# Altium project Brd_3_PCB_Golden_Arduino.PrjPcb
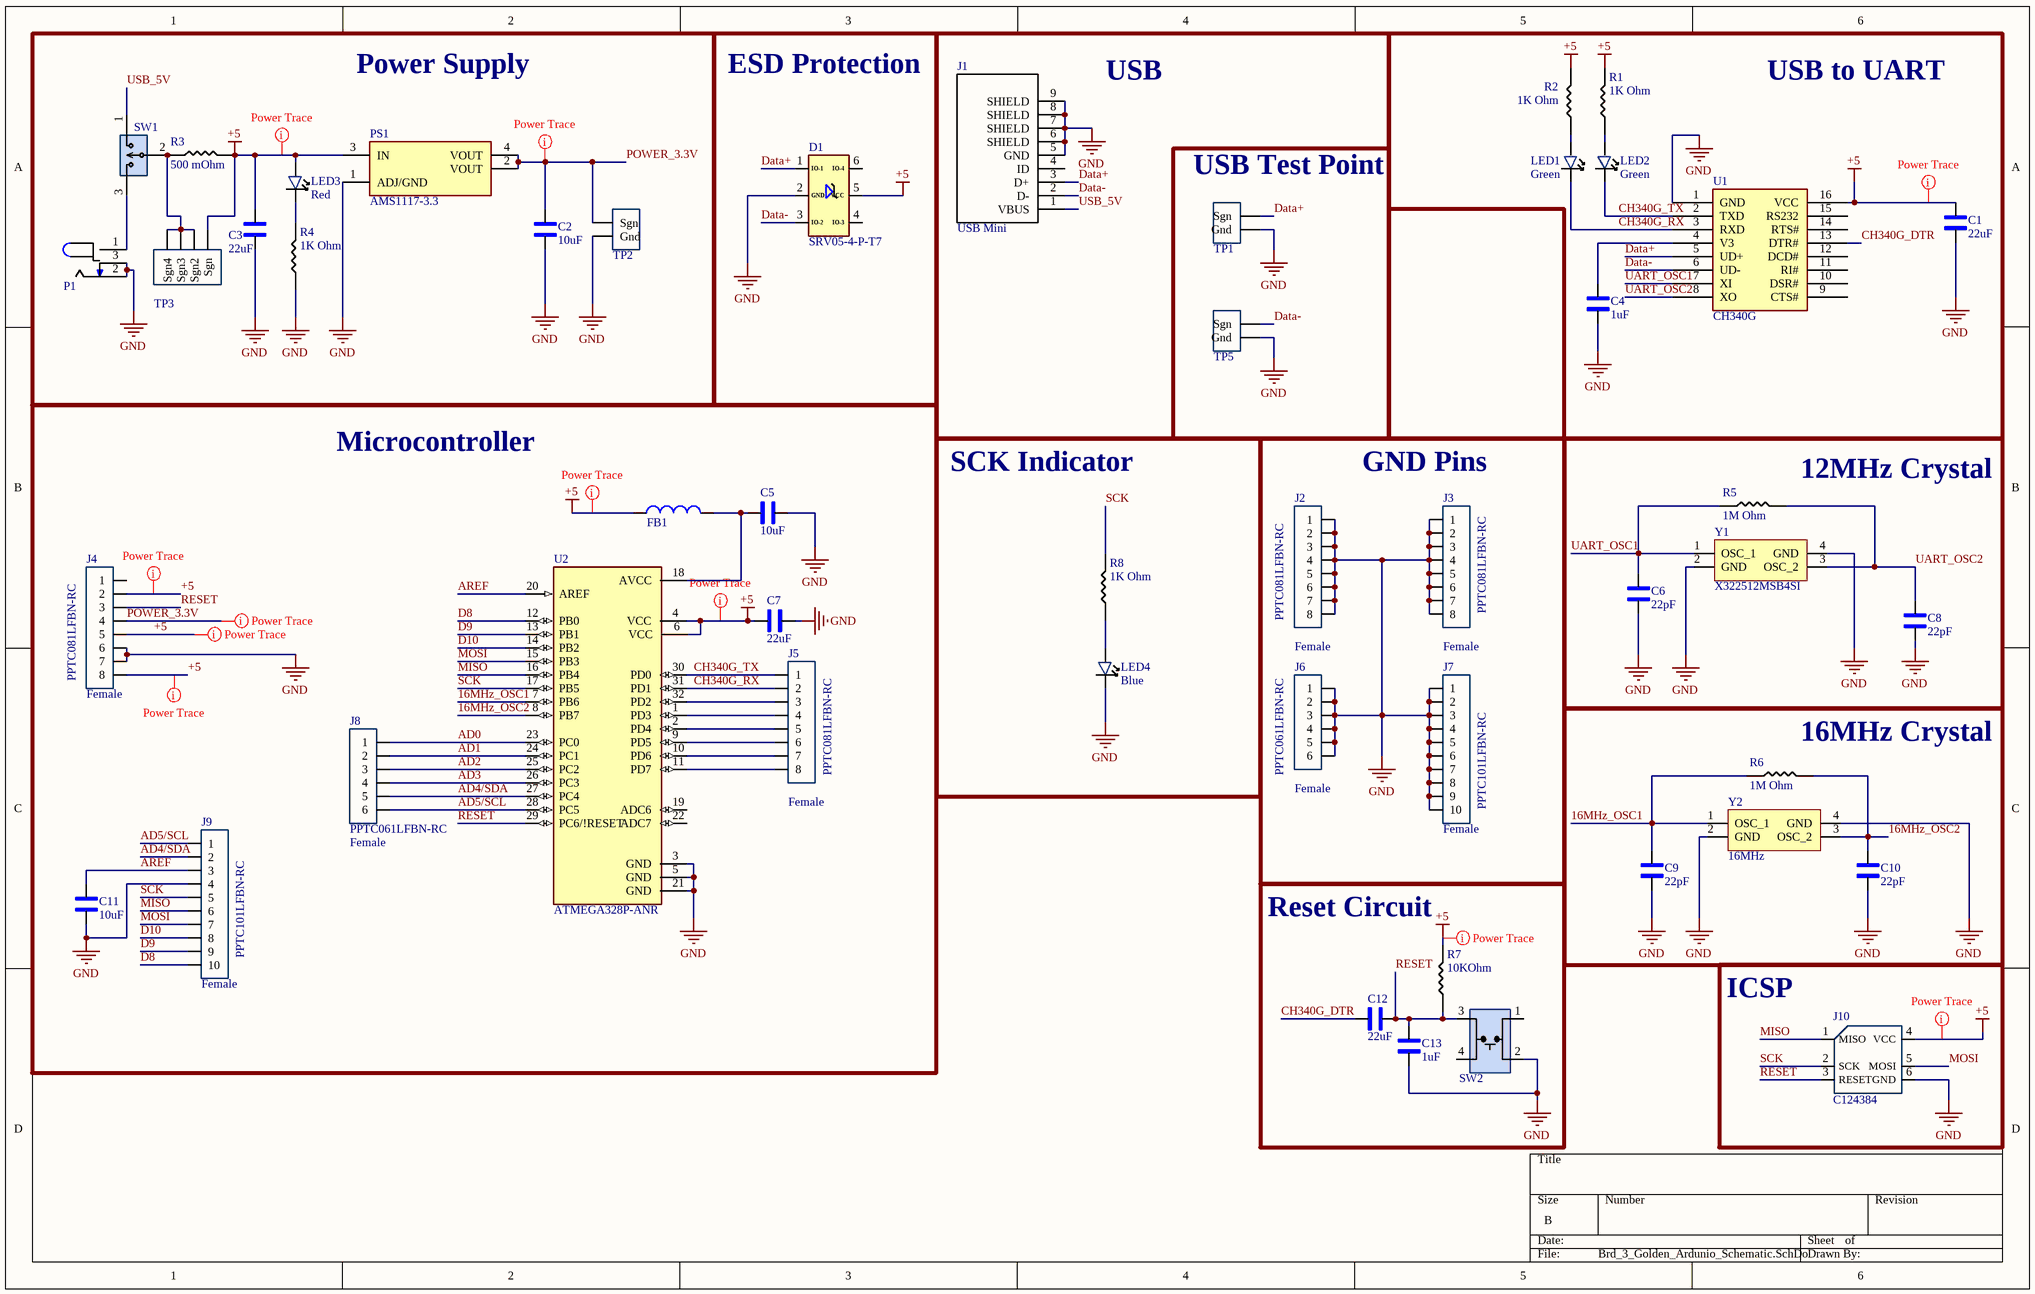
[diagram p0: Brd_3_Golden_Ardunio_Schematic.SchDoc]
1 sheet, 49 parts. Net scope: global (net labels, ports and power ports of the same name join across sheets).
Board file: Brd_3_Golden_Arduino_Layout.PcbDoc

## Sheet Brd_3_Golden_Ardunio_Schematic.SchDoc
size B; SheetNumber: 1; SheetTotal: 1

### Parts
C1  22uF  [0805_Passive_Capaciitor]
C2  10uF  [0402_Passive_Capacitor]
C3  22uF  [0805_Passive_Capaciitor]
C4  1uF  [0402_Passive_Capacitor]
C5  10uF  [0402_Passive_Capacitor]
C6  22pF  [0402_Passive_Capacitor]
C7  22uF  [0805_Passive_Capaciitor]
C8  22pF  [0402_Passive_Capacitor]
C9  22pF  [0402_Passive_Capacitor]
C10  22pF  [0402_Passive_Capacitor]
C11  10uF  [0402_Passive_Capacitor]
C12  22uF  [0805_Passive_Capaciitor]
C13  1uF  [0402_Passive_Capacitor]
D1  SRV05-4-P-T7  [TVS]
FB1  FB_10uH_0603  [0603_PASSIVE_Capacitor]  (value not drawn)
J1  USB Mini  [USB_MINI_B]
J2  PPTC081LFBN-RC  value Female  [8_PIN_ARDUINO_100MIL]
J3  PPTC081LFBN-RC  value Female  [8_PIN_ARDUINO_100MIL]
J4  PPTC081LFBN-RC  value Female  [8_PIN_ARDUINO_100MIL]
J5  PPTC081LFBN-RC  value Female  [8_PIN_ARDUINO_100MIL]
J6  PPTC061LFBN-RC  value Female  [6_PIN_ARDUINO_100mil]
J7  PPTC101LFBN-RC  value Female  [10_PIN_ARDUINO_100MIL]
J8  PPTC061LFBN-RC  value Female  [6_PIN_ARDUINO_100mil]
J9  PPTC101LFBN-RC  value Female  [10_PIN_ARDUINO_100MIL]
J10  LCSC Part#: C124384  [ICSP]  (hidden comment: NRPN032PAEN-RC)
LED1  value Green  [LED_0603]  (hidden comment: KT-0603R)
LED2  value Green  [LED_0603]  (hidden comment: KT-0603R)
LED3  value Red  [LED_0603]  (hidden comment: KT-0603R)
LED4  value Blue  [LED_0603]  (hidden comment: KT-0603R)
P1  Power Jack  [Power_Jack]  (value not drawn)
PS1  AMS1117-3.3  [LDO]
R1  value 1K Ohm  [0402_Passive_Resistor]  (hidden comment: 1k)
R2  value 1K Ohm  [0402_Passive_Resistor]  (hidden comment: 1k)
R3  value 500 mOhm  [0603_PASSIVE_Resistor]  (hidden comment: 500m)
R4  value 1K Ohm  [0402_Passive_Resistor]  (hidden comment: 1k)
R5  value 1M Ohm  [1206_Passive_Resitor]  (hidden comment: 1M)
R6  value 1M Ohm  [1206_Passive_Resitor]  (hidden comment: 1M)
R7  value 10KOhm  [0402_Passive_Resistor]  (hidden comment: 10k)
R8  value 1K Ohm  [0402_Passive_Resistor]  (hidden comment: 1k)
SW1  PREC003SAAN-RC  [3_PIN_100mil]  (value not drawn)
SW2  TL3305AF160QG  [Switch_JLC]  (value not drawn)
TP1  10x Probe TP  [TP10x_Probe]  (value not drawn)
TP2  10x Probe TP  [TP10x_Probe]  (value not drawn)
TP3  10x Probe Floating TP  [TP10x_Floating]  (value not drawn)
TP5  10x Probe TP  [TP10x_Probe]  (value not drawn)
U1  CH340G  [USB to serial]
U2  ATMEGA328P-ANR  [ATMega328P]
Y1  X322512MSB4SI  [Crystal resonator]
Y2  value 16MHz  [Crystal resonator]  (hidden comment: X322516MLB4SI)

### Blocks framed on the sheet
Power Supply: C2 C3 LED3 P1 PS1 R3 R4 SW1 TP2 TP3
ESD Protection: D1
USB: J1
USB to UART: C1 C4 LED1 LED2 R1 R2 U1
USB Test Point: TP1 TP5
Microcontroller: C5 C7 C11 FB1 J4 J5 J8 J9 U2
SCK Indicator: LED4 R8
GND Pins: J2 J3 J6 J7
12MHz Crystal: C6 C8 R5 Y1
16MHz Crystal: C9 C10 R6 Y2
Reset Circuit: C12 C13 R7 SW2
ICSP: J10

### Nets
+5: C1.2 C3.2 C7.1 D1.5(VCC) FB1.1 J4.2 J4.5 J4.8 J10.4(VCC) LED3.1 PS1.3(IN) R1.2 R2.2 R3.2 R7.2 TP3.1(Sgn) U1.16(VCC) U2.4(VCC) U2.6(VCC)
GND: C1.1 C2.1 C3.1 C4.1 C5.2 C6.1 C7.2 C8.1 C9.1 C10.1 C11.1 C13.1 D1.2(GND) J1.5(GND) J1.6(SHIELD) J1.7(SHIELD) J1.8(SHIELD) J1.9(SHIELD) J2.1 J2.2 J2.3 J2.4 J2.5 J2.6 J2.7 J2.8 J3.1 J3.2 J3.3 J3.4 J3.5 J3.6 J3.7 J3.8 J4.6 J4.7 J6.1 J6.2 J6.3 J6.4 J6.5 J6.6 J7.1 J7.2 J7.3 J7.4 J7.5 J7.6 J7.7 J7.8 J7.9 J7.10 J9.4 J10.6(GND) LED4.2 P1.2 P1.3 PS1.1(ADJ/GND) R4.1 SW2.2 TP1.2(Gnd) TP2.2(Gnd) TP5.2(Gnd) U1.1(GND) U2.3(GND) U2.5(GND) U2.21(GND) Y1.2(GND) Y1.4(GND) Y2.2(GND) Y2.4(GND)
16MHz_OSC1: C9.2 R6.1 U2.7(PB6) Y2.1(OSC_1)
16MHz_OSC2: C10.2 R6.2 U2.8(PB7) Y2.3(OSC_2)
AD0: J8.1 U2.23(PC0)
AD1: J8.2 U2.24(PC1)
AD2: J8.3 U2.25(PC2)
AD3: J8.4 U2.26(PC3)
AD4/SDA: J8.5 J9.2 U2.27(PC4)
AD5/SCL: J8.6 J9.1 U2.28(PC5)
AREF: C11.2 J9.3 U2.20(AREF)
CH340G_DTR: C12.1 U1.13(DTR#)
CH340G_RX: J5.2 LED1.2 U1.3(RXD) U2.31(PD1)
CH340G_TX: J5.1 LED2.2 U1.2(TXD) U2.30(PD0)
D8: J9.10 U2.12(PB0)
D9: J9.9 U2.13(PB1)
D10: J9.8 U2.14(PB2)
Data+: D1.1(IO-1) J1.3(D+) TP1.1(Sgn) U1.5(UD+)
Data-: D1.3(IO-2) J1.2(D-) TP5.1(Sgn) U1.6(UD-)
MISO: J9.6 J10.1(MISO) U2.16(PB4)
MOSI: J9.7 J10.5(MOSI) U2.15(PB3)
POWER_3.3V: C2.2 J4.4 PS1.2(VOUT) PS1.4(VOUT) TP2.1(Sgn)
RESET: C12.2 C13.2 J4.3 J10.3(RESET) R7.1 SW2.3 U2.29(PC6/!RESET)
SCK: J9.5 J10.2(SCK) R8.2 U2.17(PB5)
UART_OSC1: C6.2 R5.1 U1.7(XI) Y1.1(OSC_1)
UART_OSC2: C8.2 R5.2 U1.8(XO) Y1.3(OSC_2)
USB_5V: J1.1(VBUS) SW1.1
NetC4_2: C4.2 U1.4(V3)
NetC5_1: C5.1 FB1.2 U2.18(AVCC)
NetJ5_3: J5.3 U2.32(PD2)
NetJ5_4: J5.4 U2.1(PD3)
NetJ5_5: J5.5 U2.2(PD4)
NetJ5_6: J5.6 U2.9(PD5)
NetJ5_7: J5.7 U2.10(PD6)
NetJ5_8: J5.8 U2.11(PD7)
NetLED1_1: LED1.1 R2.1
NetLED2_1: LED2.1 R1.1
NetLED3_2: LED3.2 R4.2
NetLED4_1: LED4.1 R8.1
NetP1_1: P1.1 SW1.3
NetR3_1: R3.1 SW1.2 TP3.2(Sgn2) TP3.3(Sgn3) TP3.4(Sgn4)

Not connected (* = marked no-connect by the designer): D1 4(IO-3) 6(IO-4); J1 4(ID); J4 1; SW2 1 4; U1 9(CTS#) 10(DSR#) 11(RI#) 12(DCD#) 14(RTS#) 15(RS232); U2 19(ADC6) 22(ADC7)

### Layout directives
rule Width Constraint [Pref Width = 20mil    Min Width = 20mil    Max Width = 20mil]: +5, POWER_3.3V

### Library data of the parts
C1 C3 C7 C12 = C_22uF_0805: MULTILAYER CERAMIC CAPACITORS MLCC - SMD/SMT 22UF 25V 0805 ROHS; MFR Part #: CL21A226MAQNNNE; Type: Basic; Datasheet: https://datasheet.lcsc.com/szlcsc/Samsung-Electro-Mechanics-CL21A226MAQNNNE_C45783.pdf; LCSC Part#: C45783; Value: 22uF
C2 C5 C11 = C_10uF_0402: 10uF ±20% 6.3V X5R 0402 Multilayer Ceramic Capacitors MLCC - SMD/SMT RoHS; MFR Part #: CL05A106MQ5NUNC; Type: Basic; LCSC Part#: C15525; Datasheet: https://datasheet.lcsc.com/lcsc/1810191215_Samsung-Electro-Mechanics-CL05A106MQ5NUNC_C15525.pdf; Value: 10uF
C4 C13 = C_1uF_0402: MULTILAYER CERAMIC CAPACITORS MLCC - SMD/SMT 1UF 25V 0402 ROHS; MFR Part #: CL05A105KA5NQNC; Type: Basic; Datasheet: https://datasheet.lcsc.com/szlcsc/Samsung-Electro-Mechanics-CL05A105KA5NQNC_C52923.pdf; LCSC Part#: C52923; Value: 1uF
C6 C8-C10 = C_22pF_0402: MULTILAYER CERAMIC CAPACITORS MLCC - SMD/SMT 22PF 50V 0402 ROHS; MFR Part #: 0402CG220J500NT; Type: Basic; Datasheet: https://datasheet.lcsc.com/szlcsc/Guangdong-Fenghua-Advanced-Tech-0402CG220J500NT_C1555.pdf; LCSC Part#: C1555; Value: 22pF
D1 = D_TVS_Diode: TVS SOT-23-6 ROHS; Value: TVS DIODE 5.5V 6TSOP; Type: Basic; MFR Part #: SRV05-4-P-T7; LCSC Part#: C85364; Datasheet: https://datasheet.lcsc.com/szlcsc/ProTek-Devices-SRV05-4-P-T7_C85364.pdf
FB1 = FB_10uH_0603: 10 uH, 30 Q, 1.85 Ohm Series Resistance, 17MHz Self Resonant Frequency,Inductor , SMD 0603, 3 Amps rated current; MFR Part #: SDFL1608S100KTF; Type: Basic; Datasheet: https://datasheet.lcsc.com/szlcsc/Sunlord-SDFL1608S100KTF_C1035.pdf; LCSC Part#: C1035
J1 = J_USB_B_Mini: Through Hole USB Connectors RoHS; MFR Part #: 920-462A2021D10102; Value: USB mini B; LCSC Part#: C46398; Datasheet: https://datasheet.lcsc.com/szlcsc/2103081233_Jing-Extension-of-the-Electronic-Co-920-462A2021D10102_C46398.pdf; Type: Extended
J2-J5 = JF_8_PIN_FEMALE_ARDUINO: 8 Position Header Connector 0.100" (2.54mm) Through Hole Tin; Digikey Link: https://www.digikey.com/product-detail/en/PPTC081LFBN-RC/S7006-ND/810147/?itemSeq=304982354; Digikey Part: S7006-ND; Type: Extended; LCSC Part#: C27438
J6 J8 = JF_6_PIN_FEMALE_ARDUINO: 6 Position Header Connector 0.100" (2.54mm) Through Hole Tin; Digikey Link: https://www.digikey.com/product-detail/en/PPTC061LFBN-RC/S7004-ND/810145/?itemSeq=304982353; Digikey Part: S7004-ND; LCSC Part#: C40877; Type: Extended
J7 J9 = JF_10_PIN_FEMALE_ARDUINO: 10 Position Header Connector 0.100" (2.54mm) Through Hole Tin; Digikey Link: https://www.digikey.com/product-detail/en/PPTC101LFBN-RC/S7008-ND/810149/?itemSeq=304982352; Digikey Part: S7008-ND; LCSC Part#: C225507; Type: Extended
J10 = J_ICSP: Connector Header Through Hole 6 position 0.079" (2.00mm); Digikey Link: https://www.digikey.com/product-detail/en/NRPN032PAEN-RC/S5801-03-ND/804955/?itemSeq=304982355; Digikey Part: S5801-03-ND; Value: NRPN032PAEN-RC; Type: Extended
LED1 LED2 = LED_GREEN_0603: LIGHT EMITTING DIODES (LED) GREEN 520~535NM 112~258MCD@20MA TOP VIEW 0603 ROHS; MFR Part #: 19-217/GHC-YR1S2/3T; Type: Basic; LCSC Part#: C72043
LED3 = LED_RED_0603: LIGHT EMITTING DIODES (LED) RED 520~625NM 90~100MCD@20MA TOP VIEW 0603 ROHS; Type: Basic; Datasheet: https://datasheet.lcsc.com/szlcsc/Everlight-Elec-19-217-BHC-ZL1M2RY-3T_C72041.pdf; MFR Part #: KT-0603R; LCSC Part#: C2286
LED4 = LED_BLUE_0603: LIGHT EMITTING DIODES (LED) BLUE 465~475NM 11.5~28.5MCD@5MA TOP VIEW 0603 ROHS; MFR Part #: 19-217/BHC-ZL1M2RY/3T; Type: Basic; LCSC Part#: C72041
P1 = P_Power Jack: Power Barrel Connector Jack 2.10mm ID (0.083"), 5.50mm OD (0.217") Through Hole, Right Angle; Value: CONN PWR JACK 2X5.5MM SOLDER; Digikey Link: https://www.digikey.com/product-detail/en/PJ-102A/CP-102A-ND/275425/?itemSeq=304982367; Digikey Part: CP-102A-ND; LCSC Part#: C136744; Type: Extended
PS1 = PS_AMS_LDO_3v3: LOW DROPOUT REGULATORS(LDO) POSITIVE FIXED 1.3V @ 800MA 15V 3.3V 1A SOT-223 ROHS; Value: IC REG LINEAR 3.3V 800MA SOT223; MFR Part #: AMS1117-3.3; LCSC Part#: C6186; Type: Basic
R1 R2 R4 R8 = R_1K_0402: 1 kOhms chip resistor SURFACE MOUNT 1KOHMS ±1% 1/16W 0402 ROHS; MFR Part #: 0402WGF1001TCE; Datasheet: https://datasheet.lcsc.com/szlcsc/Uniroyal-Elec-0402WGF1001TCE_C11702.pdf; LCSC Part#: C11702; Type: Basic
R3 = R_500m_0603: CHIP RESISTOR - SURFACE MOUNT 0.5OHMS ±1% 1/10W 0603 ROHS; MFR Part #: 0603WAF500LT5E; Datasheet: https://datasheet.lcsc.com/szlcsc/SUP-MRMF3216-1206-LR005FTN_C76290.pdf; LCSC Part#: C45312; Type: Extended
R5 R6 = R_1M_1206: CHIP RESISTOR - SURFACE MOUNT 1MOHMS ±1% 1/4W 1206 ROHS; Digikey Link: https://www.digikey.com/product-detail/en/RMCF1206JT1M00/RMCF1206JT1M00CT-ND/1942830/?itemSeq=304982358; Digikey Part: Number RMCF1206JT1M00CT-ND; LCSC Part#: C17927; Type: Basic
R7 = R_10KOhm_0402: CHIP RESISTOR - SURFACE MOUNT 10KOHMS ±1% 1/16W 0402 ROHS; MFR Part #: 0402WGF1002TCE; Datasheet: https://datasheet.lcsc.com/szlcsc/Uniroyal-Elec-0402WGF1002TCE_C25744.pdf; LCSC Part#: C25744; Type: Basic
SW1 = SW_3Pin_100mil_Switch: Connector Header Through Hole 3 position 0.100" (2.54mm); Value: CONN HEADER VERT 3POS 2.54MM; Digikey Link: https://www.digikey.com/product-detail/en/PREC003SAAN-RC/S1012EC-03-ND/2774851/?itemSeq=304982371; Digikey Part: S1012EC-03-ND; Type: Extended; LCSC Part#: C429954
SW2 = SW_Push_Button_JLC: Tactile Switch SPST-NO Top Actuated Surface Mount; MFR Part #: C174049; LCSC Part#: C174049; Type: Extended
TP1 TP2 TP5 = TP_10x_Probe: Test Point 300 mil centers
TP3 = TP_10x_Floating: Test Point 300 mil centers
U1 = U_USBtoSerial: Transceiver USB 2.0 2Mbps SOP-16_150mil USB ICs RoHS; Datasheet: https://datasheet.lcsc.com/lcsc/2008191806_WCH-Jiangsu-Qin-Heng-CH340G_C14267.pdf; LCSC Part#: C14267; MFR Part #: CH340G; Type: Basic; Value: USB to Serial
U2 = U_ATMega328P: AVR AVR® ATmega Microcontroller IC 8-Bit 20MHz 32KB (16K x 16) FLASH 32-TQFP (7x7); MFR Part #: ATMEGA328P-AU; Value: IC MCU 8BIT 32KB FLASH 32TQFP; Digikey Link: https://www.digikey.com/product-detail/en/ATMEGA328P-ANR/ATMEGA328P-ANRCT-ND/2774230/?itemSeq=304982365; LCSC Part#: C14877; Type: Basic
Y1 = X_12MHz_Res: SMD Crystal Resonators 12MHz ±10ppm SMD-3225_4P RoHS; LCSC Part#: C9002; MFR Part #: X322512MSB4SI; Value: 12MHz; Type: Basic; Datasheet: https://datasheet.lcsc.com/szlcsc/Yangxing-Tech-X322512MSB4SI_C9002.pdf
Y2 = X_16Mhz_Res: ±10ppm 16000000Hz -40℃~85℃ 贴片无源晶振 60Ω 9pF SMD3225-4P Crystals ROHS; LCSC Part#: C13738; MFR Part #: X322516MLB4SI; Type: Basic